# Altium project EE_smallOB_BW_v1.0.PrjPcb (part 3 of 4)

## Sheet ADS_2.SchDoc
size A
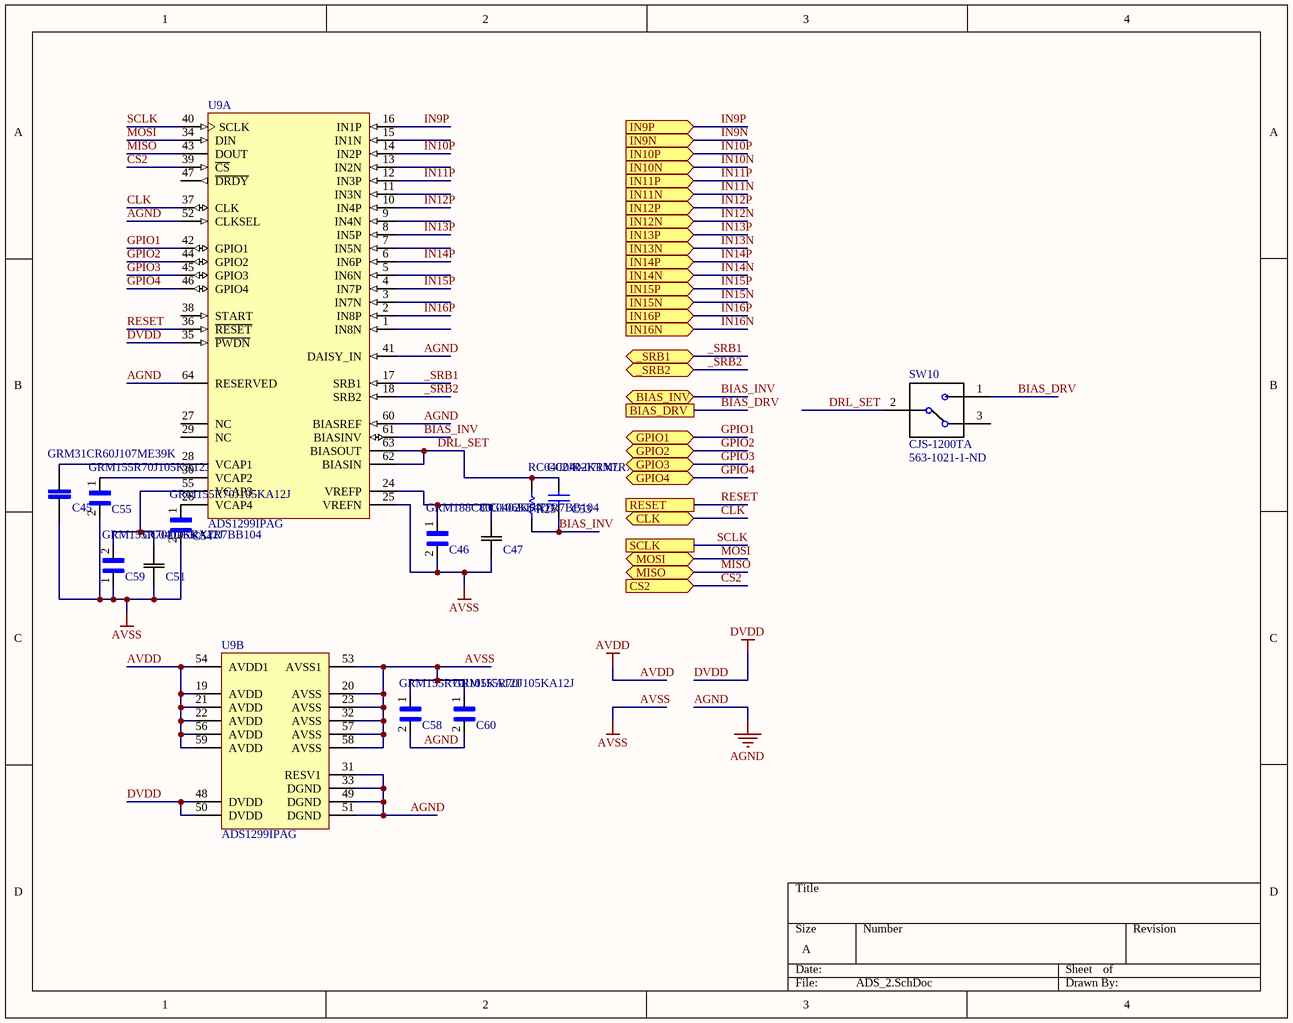
[diagram p2: ADS_2.SchDoc]

### Parts
C45  GRM31CR60J107ME39K  [*CAPC3216X190]
C46  GRM188C80G106KE47D  [*CAPC1608X90N]
C47  CC0402KRX7R7BB104  [YAG_CC0402]
C51  CC0402KRX7R7BB104  [YAG_CC0402]
C53  CC0402KRX7R7BB102  [CAPC1005X55X23NL05T08]
C54  GRM155R70J105KA12J  [*CAPC1005X55N]
C55  GRM155R70J105KA12J  [*CAPC1005X55N]
C58  GRM155R70J105KA12J  [*CAPC1005X55N]
C59  GRM155R70J105KA12J  [*CAPC1005X55N]
C60  GRM155R70J105KA12J  [*CAPC1005X55N]
R25  RC0402JR-071ML  [RESC1005X40X25NL05T10]
SW10  CJS-1200TA  Supplier Part Number 1: 563-1021-1-ND  [*SW_CJS-1200TA]
U9  ADS1299IPAG  [PAG0064A_N]  (parts A,B of 2)

### Ports
_SRB1 (bidir), _SRB2 (bidir), BIAS_DRV, BIAS_INV (bidir), CLK (bidir), CS2 (in), GPIO1 (bidir), GPIO2 (bidir), GPIO3 (bidir), GPIO4 (bidir), IN9N (in), IN9P (in), IN10N (in), IN10P (in), IN11N (in), IN11P (in), IN12N (in), IN12P (in), IN13N (in), IN13P (in), IN14N (in), IN14P (in), IN15N (in), IN15P (in), IN16N (in), IN16P (in), MISO (bidir), MOSI (bidir), RESET, SCLK

### Nets
AGND: C58.2 C60.2 U9.31(RESV1) U9.33(DGND) U9.41(DAISY_IN) U9.49(DGND) U9.51(DGND) U9.52(CLKSEL) U9.60(BIASREF) U9.64(RESERVED)
AVDD: U9.19(AVDD) U9.21(AVDD) U9.22(AVDD) U9.54(AVDD1) U9.56(AVDD) U9.59(AVDD)
AVSS: C45.2 C46.2 C47.2 C51.1 C54.2 C55.2 C58.1 C59.1 C60.1 U9.20(AVSS) U9.23(AVSS) U9.25(VREFN) U9.32(AVSS) U9.53(AVSS1) U9.57(AVSS) U9.58(AVSS)
DVDD: U9.35(~{PWDN}) U9.48(DVDD) U9.50(DVDD)
_SRB1: U9.17(SRB1) ; port _SRB1
_SRB2: U9.18(SRB2) ; port _SRB2
BIAS_DRV: SW10.1 ; port BIAS_DRV
BIAS_INV: C53.2 R25.2 U9.61(BIASINV) ; port BIAS_INV
CLK: U9.37(CLK) ; port CLK
CS2: U9.39(~{CS}) ; port CS2
DRL_SET: C53.1 R25.1 SW10.2 U9.62(BIASIN) U9.63(BIASOUT)
GPIO1: U9.42(GPIO1) ; port GPIO1
GPIO2: U9.44(GPIO2) ; port GPIO2
GPIO3: U9.45(GPIO3) ; port GPIO3
GPIO4: U9.46(GPIO4) ; port GPIO4
IN9N: port IN9N
IN9P: U9.16(IN1P) ; port IN9P
IN10N: port IN10N
IN10P: U9.14(IN2P) ; port IN10P
IN11N: port IN11N
IN11P: U9.12(IN3P) ; port IN11P
IN12N: port IN12N
IN12P: U9.10(IN4P) ; port IN12P
IN13N: port IN13N
IN13P: U9.8(IN5P) ; port IN13P
IN14N: port IN14N
IN14P: U9.6(IN6P) ; port IN14P
IN15N: port IN15N
IN15P: U9.4(IN7P) ; port IN15P
IN16N: port IN16N
IN16P: U9.2(IN8P) ; port IN16P
MISO: U9.43(DOUT) ; port MISO
MOSI: U9.34(DIN) ; port MOSI
RESET: U9.36(~{RESET}) ; port RESET
SCLK: U9.40(SCLK) ; port SCLK
NetC45_1: C45.1 U9.28(VCAP1)
NetC46_1: C46.1 C47.1 U9.24(VREFP)
NetC51_2: C51.2 C59.2 U9.55(VCAP3)
NetC54_1: C54.1 U9.26(VCAP4)
NetC55_1: C55.1 U9.30(VCAP2)

Not connected (* = marked no-connect by the designer): SW10 3; U9 1(IN8N) 3(IN7N) 5(IN6N) 7(IN5N) 9(IN4N) 11(IN3N) 13(IN2N) 15(IN1N) 27(NC) 29(NC) 38(START) 47(~{DRDY})

### Library data of the parts
C45 = GRM31CR60J107ME39K: MURATA - GRM31CR60J107ME39K - COND, 100µF, 6.3V, 20%, X5R, 1206; Capacitance: 100uF; Supplier 1: Digi-Key; Manufacturer 1: Murata; Manufacturer Part Number 1: GRM31CR60J107ME39K; Stock 1: 407390; Pricing 1: 1=0.98000, 10=0.77400, 100=0.58060, 500=0.43870, 1000=0.38709, 2500=0.36128 (USD); RoHS: Yes; Mount: Surface Mount; Case/Package: 1206; Case Code (Imperial): 1206; Case Code (Metric): 3216; Min Operating Temperature: -55°C; Max Operating Temperature: 85°C; Tolerance: 20%; Packaging: Tape and Reel; Package Quantity: 1; Voltage Rating: 6.3V; Dielectric: X5R; Termination: SMD/SMT; Voltage: 6.3V; Voltage Rating (DC): 6.3V; Length: 3.2mm; Height: 1.6mm; Width: 0.063inch; Thickness: 0.071inch; Depth: 1.6mm; Radiation Hardening: No; REACH SVHC: No SVHC; Lead Free: Lead Free; ComponentLink1URL: https://datasheet.ciiva.com/13246/product-13246228.pdf?src-supplier=Mouser; ComponentLink1Description: https://datasheet.ciiva.com/13246/product-13246228.pdf?src-supplier=Mouser; ComponentLink2URL: https://datasheet.ciiva.com/18697/grm31cr60j107me39-01-18697367.pdf?src-supplier=Digi-Key; ComponentLink2Description: https://datasheet.ciiva.com/18697/grm31cr60j107me39-01-18697367.pdf?src-supplier=Digi-Key; ComponentLink3URL: https://datasheet.ciiva.com/18697/grm31cr60j107me39-01-18697368.pdf?src-supplier=Digi-Key; ComponentLink3Description: https://datasheet.ciiva.com/18697/grm31cr60j107me39-01-18697368.pdf?src-supplier=Digi-Key; ComponentLink4URL: https://datasheet.ciiva.com/18697/grm31cr60j107me39-01-18697369.pdf?src-supplier=Digi-Key; ComponentLink4Description: https://datasheet.ciiva.com/18697/grm31cr60j107me39-01-18697369.pdf?src-supplier=Digi-Key; Supplier Part Number 1: 490-7217-1-ND
C46 = GRM188C80G106KE47D: CAP CER 10UF 4V X6S 0603; Manufacturer 1: Murata; Tolerance: 10%; Supplier 1: Digi-Key; Manufacturer Part Number 1: GRM188C80G106KE47D; Stock 1: 203819; Pricing 1: 1=0.17000, 10=0.11800, 100=0.05990, 500=0.04098, 1000=0.03625 (USD); RoHS: Yes; Mount: Surface Mount; Case/Package: 0603; Weight: 0.000222oz; Case Code (Metric): 1608; Case Code (Imperial): 0603; Min Operating Temperature: -55°C; Max Operating Temperature: 105°C; Capacitance: 10uF; Packaging: Tape and Reel; Voltage Rating: 4V; Dielectric: X6S; Termination: SMD/SMT; Voltage Rating (DC): 4V; Package Quantity: 4000; Length: 0.063inch; Height: 0.8mm; Width: 0.031inch; Thickness: 0.035inch; ComponentLink1URL: http://www.mouser.com/ds/2/281/c02e-2905.pdf?src-supplier=Mouser; ComponentLink1Description: http://www.mouser.com/ds/2/281/c02e-2905.pdf?src-supplier=Mouser; ComponentLink2URL: http://search.murata.co.jp/Ceramy/image/img/A01X/G101/ENG/GRM188C80G106KE47-01.pdf?src-supplier=Digi-Key; ComponentLink2Description: http://search.murata.co.jp/Ceramy/image/img/A01X/G101/ENG/GRM188C80G106KE47-01.pdf?src-supplier=Digi-Key; Supplier Part Number 1: 490-10469-1-ND
C47 C51 = CC0402KRX7R7BB104: CAP CER 0.1UF 16V X7R 0402; Manufacturer 1: Yageo; Capacitance: 100nF; Tolerance: 10%; Supplier 1: Digi-Key; Manufacturer Part Number 1: CC0402KRX7R7BB104; Stock 1: 30032352; Pricing 1: 1=0.10000, 10=0.03200, 100=0.01420, 500=0.01014, 1000=0.00797, 2500=0.00724, 5000=0.00667 (USD); RoHS: Yes; Mount: Surface Mount; Case/Package: 0402; Number of Pins: 2; Case Code (Metric): 1005; Case Code (Imperial): 0402; Min Operating Temperature: -55°C; Max Operating Temperature: 125°C; Voltage Rating: 16V; Voltage Rating (DC): 16V; Packaging: Tape and Reel; Package Quantity: 1; Dielectric: X7R; Termination: SMD/SMT; Composition: Ceramic; Voltage: 16V; Length: 1mm; Height: 0.5mm; Width: 0.02inch; Thickness: 0.022inch; Depth: 0.5mm; Radiation Hardening: No; REACH SVHC: No SVHC; Lead Free: Lead Free; Halogen Free: Halogen Free; ComponentLink1URL: https://datasheet.ciiva.com/11788/0900766b80ce67ed-11788364.pdf?src-supplier=RSComponents; ComponentLink1Description: https://datasheet.ciiva.com/11788/0900766b80ce67ed-11788364.pdf?src-supplier=RSComponents; ComponentLink2URL: https://datasheet.ciiva.com/16625/upy-gphc-x7r-6-3v-to-50v-8-16625511.pdf?src-supplier=Avnet+Europe; ComponentLink2Description: https://datasheet.ciiva.com/16625/upy-gphc-x7r-6-3v-to-50v-8-16625511.pdf?src-supplier=Avnet+Europe; ComponentLink3URL: https://datasheet.ciiva.com/161/mlccorderingcode-161544.pdf?src-supplier=Digi-Key; ComponentLink3Description: https://datasheet.ciiva.com/161/mlccorderingcode-161544.pdf?src-supplier=Digi-Key; ComponentLink4URL: https://datasheet.ciiva.com/161/mlccorderingcode-161545.pdf?src-supplier=Digi-Key; ComponentLink4Description: https://datasheet.ciiva.com/161/mlccorderingcode-161545.pdf?src-supplier=Digi-Key; ComponentLink5URL: https://datasheet.ciiva.com/8033/1734573-8033661.pdf?src-supplier=Element14; ComponentLink5Description: https://datasheet.ciiva.com/8033/1734573-8033661.pdf?src-supplier=Element14; ComponentLink6URL: https://datasheet.ciiva.com/7978/1489800-7978111.pdf?src-supplier=Element14; ComponentLink6Description: https://datasheet.ciiva.com/7978/1489800-7978111.pdf?src-supplier=Element14; ComponentLink7URL: https://datasheet.ciiva.com/8033/1734573-8033663.pdf?src-supplier=Element14; ComponentLink7Description: https://datasheet.ciiva.com/8033/1734573-8033663.pdf?src-supplier=Element14; ComponentLink8URL: https://datasheet.ciiva.com/11587/upy-gphc-x7r-6-3v-to-50v-8-11587305.pdf?src-supplier=Avnet; ComponentLink8Description: https://datasheet.ciiva.com/11587/upy-gphc-x7r-6-3v-to-50v-8-11587305.pdf?src-supplier=Avnet; ComponentLink9URL: https://datasheet.ciiva.com/161/mlccorderingcode-161546.pdf?src-supplier=Digi-Key; ComponentLink9Description: https://datasheet.ciiva.com/161/mlccorderingcode-161546.pdf?src-supplier=Digi-Key; ComponentLink10URL: https://datasheet.ciiva.com/13395/upy-gphc-x7r-6-3v-to-50v-8-13395676.pdf?src-supplier=Mouser; ComponentLink10Description: https://datasheet.ciiva.com/13395/upy-gphc-x7r-6-3v-to-50v-8-13395676.pdf?src-supplier=Mouser; ComponentLink11URL: https://datasheet.ciiva.com/28450/1489800-28450335.pdf?src-supplier=Element14; ComponentLink11Description: https://datasheet.ciiva.com/28450/1489800-28450335.pdf?src-supplier=Element14; Supplier Part Number 1: 311-1338-1-ND
C53 = CC0402KRX7R7BB102: CAP CER 1000PF 16V X7R 0402; Manufacturer 1: Yageo; Capacitance: 1nF; Tolerance: 10%; Supplier 1: Digi-Key; Manufacturer Part Number 1: CC0402KRX7R7BB102; Stock 1: 319318; Pricing 1: 1=0.10000, 10=0.02000, 100=0.00910, 500=0.00646, 1000=0.00508, 2500=0.00462, 5000=0.00425 (USD); RoHS: Yes; Mount: Surface Mount; Case/Package: 0402; Case Code (Imperial): 0402; Case Code (Metric): 1005; Min Operating Temperature: -55°C; Max Operating Temperature: 125°C; Packaging: Tape and Reel; Voltage Rating: 16V; Voltage Rating (DC): 16V; Package Quantity: 1; Dielectric: X7R; Termination: SMD/SMT; Composition: Ceramic; Length: 1mm; Height: 0.5mm; Width: 0.5mm; Thickness: 0.022inch; Depth: 0.5mm; Radiation Hardening: No; REACH SVHC: No SVHC; Lead Free: Lead Free; Halogen Free: Halogen Free; ComponentLink1URL: https://datasheet.ciiva.com/143/mlccorderingcode-143963.pdf?src-supplier=Digi-Key; ComponentLink1Description: https://datasheet.ciiva.com/143/mlccorderingcode-143963.pdf?src-supplier=Digi-Key; ComponentLink2URL: https://datasheet.ciiva.com/26862/getdatasheetpartid-698313-26862635.pdf?src-supplier=Verical; ComponentLink2Description: https://datasheet.ciiva.com/26862/getdatasheetpartid-698313-26862635.pdf?src-supplier=Verical; ComponentLink3URL: https://datasheet.ciiva.com/143/mlccorderingcode-143964.pdf?src-supplier=Digi-Key; ComponentLink3Description: https://datasheet.ciiva.com/143/mlccorderingcode-143964.pdf?src-supplier=Digi-Key; ComponentLink4URL: https://datasheet.ciiva.com/17437/upy-gphc-x7r-6-3v-to-50v-8-17437337.pdf?src-supplier=Avnet+Europe; ComponentLink4Description: https://datasheet.ciiva.com/17437/upy-gphc-x7r-6-3v-to-50v-8-17437337.pdf?src-supplier=Avnet+Europe; ComponentLink5URL: https://datasheet.ciiva.com/143/mlccorderingcode-143962.pdf?src-supplier=Digi-Key; ComponentLink5Description: https://datasheet.ciiva.com/143/mlccorderingcode-143962.pdf?src-supplier=Digi-Key; ComponentLink6URL: https://datasheet.ciiva.com/7978/1489800-7978107.pdf?src-supplier=Element14; ComponentLink6Description: https://datasheet.ciiva.com/7978/1489800-7978107.pdf?src-supplier=Element14; ComponentLink7URL: https://datasheet.ciiva.com/11464/upy-gphc-x7r-6-3v-to-50v-8-11464876.pdf?src-supplier=Avnet; ComponentLink7Description: https://datasheet.ciiva.com/11464/upy-gphc-x7r-6-3v-to-50v-8-11464876.pdf?src-supplier=Avnet; Supplier Part Number 1: 311-1352-1-ND
C54 C55 C58-C60 = GRM155R70J105KA12J: CAP CER 1UF 6.3V X7R 0402; Manufacturer 1: Murata; Tolerance: 10%; Supplier 1: Digi-Key; Manufacturer Part Number 1: GRM155R70J105KA12J; Stock 1: 3268614; Pricing 1: 1=0.11000, 10=0.07900, 100=0.03700, 500=0.02596, 1000=0.02149, 2500=0.02000, 5000=0.01830 (USD); RoHS: Yes; Mount: Surface Mount; Case/Package: 0402; Weight: 0.000212oz; Case Code (Metric): 1005; Case Code (Imperial): 0402; Min Operating Temperature: -55°C; Max Operating Temperature: 125°C; Packaging: Tape and Reel; Capacitance: 1uF; Voltage Rating: 6.3V; Dielectric: X7R; Termination: SMD/SMT; Voltage Rating (DC): 6.3V; Package Quantity: 50000; Length: 0.039inch; Width: 0.02inch; Thickness: 0.022inch; ComponentLink1URL: http://www.mouser.com/ds/2/281/c02e-2905.pdf?src-supplier=Mouser; ComponentLink1Description: http://www.mouser.com/ds/2/281/c02e-2905.pdf?src-supplier=Mouser; ComponentLink2URL: http://search.murata.co.jp/Ceramy/image/img/A01X/G101/ENG/GRM155R70J105KA12-01.pdf?src-supplier=Digi-Key; ComponentLink2Description: http://search.murata.co.jp/Ceramy/image/img/A01X/G101/ENG/GRM155R70J105KA12-01.pdf?src-supplier=Digi-Key; Supplier Part Number 1: 490-13339-1-ND
R25 = RC0402JR-071ML: RES SMD 1M OHM 5% 1/16W 0402; Manufacturer 1: Yageo; Resistance: 1MR; Power Rating: 62.5mW; Voltage Rating: 50V; Temperature Coefficient: 100ppm/°C; Max Power Dissipation: 63mW; Supplier 1: Digi-Key; Manufacturer Part Number 1: RC0402JR-071ML; Stock 1: 2568291; Pricing 1: 1=0.10000, 10=0.01300, 100=0.00550, 1000=0.00245, 2500=0.00212, 5000=0.00176 (USD); RoHS: Yes; Case/Package: 0402; Weight: 2.3E-05oz; Case Code (Metric): 1005; Case Code (Imperial): 0402; Min Operating Temperature: -55°C; Max Operating Temperature: 155°C; Package Quantity: 1; Tolerance: 5%; Packaging: Tape and Reel; Composition: Thick Film; Number of Terminations: 2; Termination: SMD/SMT; Military Standard: Not; Features: Moisture Resistant; Length: 1mm; Height: 0.016inch; Width: 0.02inch; Depth: 0.5mm; REACH SVHC: No SVHC; Lead Free: Lead Free; ComponentLink1URL: https://datasheet.ciiva.com/2452/pyu-r-int-thick-7-2452736.pdf?src-supplier=Digi-Key; ComponentLink1Description: https://datasheet.ciiva.com/2452/pyu-r-int-thick-7-2452736.pdf?src-supplier=Digi-Key; ComponentLink2URL: https://datasheet.ciiva.com/7983/1018594-7983560.pdf?src-supplier=Element14; ComponentLink2Description: https://datasheet.ciiva.com/7983/1018594-7983560.pdf?src-supplier=Element14; ComponentLink3URL: https://datasheet.ciiva.com/12577/pyu-rc0402-51-rohs-l-6-r-12577354.pdf?src-supplier=Mouser; ComponentLink3Description: https://datasheet.ciiva.com/12577/pyu-rc0402-51-rohs-l-6-r-12577354.pdf?src-supplier=Mouser; ComponentLink4URL: https://datasheet.ciiva.com/17085/pyu-rc0402-51-rohs-l-6-r-17085739.pdf?src-supplier=Future+Electronics; ComponentLink4Description: https://datasheet.ciiva.com/17085/pyu-rc0402-51-rohs-l-6-r-17085739.pdf?src-supplier=Future+Electronics; ComponentLink5URL: https://datasheet.ciiva.com/7850/1018594-7850172.pdf?src-supplier=Element14; ComponentLink5Description: https://datasheet.ciiva.com/7850/1018594-7850172.pdf?src-supplier=Element14; ComponentLink6URL: https://datasheet.ciiva.com/7850/1018594-7850173.pdf?src-supplier=Element14; ComponentLink6Description: https://datasheet.ciiva.com/7850/1018594-7850173.pdf?src-supplier=Element14; ComponentLink7URL: https://datasheet.ciiva.com/2452/pyu-r-int-thick-7-2452734.pdf?src-supplier=Digi-Key; ComponentLink7Description: https://datasheet.ciiva.com/2452/pyu-r-int-thick-7-2452734.pdf?src-supplier=Digi-Key; ComponentLink8URL: https://datasheet.ciiva.com/2452/pyu-r-int-thick-7-2452735.pdf?src-supplier=Digi-Key; ComponentLink8Description: https://datasheet.ciiva.com/2452/pyu-r-int-thick-7-2452735.pdf?src-supplier=Digi-Key; Supplier Part Number 1: 311-1.0MJRCT-ND
SW10 = CJS-1200TA: SWITCH SLIDE SPDT 100MA 6V; Manufacturer 1: Nidec Copal; Body Material: Polyphenylene; Number of Positions: 2; Electrical Life: 200Cycles; Max Voltage Rating (DC): 24V; Actuator Type: Slide (Standard); Washable: Yes; Supplier 1: Digi-Key; Manufacturer Part Number 1: CJS-1200TA; Stock 1: 72766; Pricing 1: 1=0.88000, 10=0.86000, 25=0.81000, 50=0.76040, 100=0.72730, 250=0.69428, 500=0.62814 (USD); RoHS: Yes; Mount: Surface Mount; Contact Material: Copper Alloy; Contact Plating: Gold; Min Operating Temperature: -40°C; Max Operating Temperature: 85°C; Packaging: Tape and Reel; Throw Configuration: SPDT; Voltage Rating (DC): 6V; Current Rating: 100mA; Termination: J-Hook; Orientation: Vertical; Length: 0.212inch; Radiation Hardening: No; Lead Free: Lead Free; ComponentLink1URL: https://datasheet.ciiva.com/2864/cjs-2864476.pdf?src-supplier=Digi-Key; ComponentLink1Description: https://datasheet.ciiva.com/2864/cjs-2864476.pdf?src-supplier=Digi-Key; ComponentLink2URL: https://datasheet.ciiva.com/2864/cjs-2864477.pdf?src-supplier=Digi-Key; ComponentLink2Description: https://datasheet.ciiva.com/2864/cjs-2864477.pdf?src-supplier=Digi-Key; ComponentLink3URL: https://datasheet.ciiva.com/2864/cjs-2864478.pdf?src-supplier=Digi-Key; ComponentLink3Description: https://datasheet.ciiva.com/2864/cjs-2864478.pdf?src-supplier=Digi-Key
U9 = ADS1299IPAG: IC AFE 24BIT 16KSPS LN 64TQFP; Manufacturer 1: Texas Instruments; Number of Channels: 8; Max Power Dissipation: 42mW; Max Supply Voltage: 5.25V; Interface: SPI; Resolution: 24b; Number of Bits: 24; Sampling Rate: 16KS/s; Operating Supply Current: 7.14mA; Signal to Noise Ratio (SNR): 121dB; Power Consumption: 41mW; Min Supply Voltage: 4.75V; Supplier 1: Digi-Key; Manufacturer Part Number 1: ADS1299IPAG; Stock 1: 447; Pricing 1: 1=55.18000, 10=51.83200, 25=50.16000, 100=46.48160 (USD); RoHS: Yes; Case/Package: TQFP; Number of Pins: 64; Contact Plating: Gold; Min Operating Temperature: -40°C; Max Operating Temperature: 85°C; Package Quantity: 160; Packaging: Rail/Tube; Number of Converters: 8; Conversion Rate: 16KS/s; Number of Inputs: 8; Number of A/D Converters: 8; Type: General Purpose; Radiation Hardening: No; Lead Free: Lead Free; REACH SVHC: No SVHC; ComponentLink1URL: https://datasheet.ciiva.com/13063/ads1299-224171-13063283.pdf?src-supplier=Mouser; ComponentLink1Description: https://datasheet.ciiva.com/13063/ads1299-224171-13063283.pdf?src-supplier=Mouser; ComponentLink2URL: https://datasheet.ciiva.com/26913/getdatasheetpartid-563195-26913237.pdf?src-supplier=Verical; ComponentLink2Description: https://datasheet.ciiva.com/26913/getdatasheetpartid-563195-26913237.pdf?src-supplier=Verical; ComponentLink3URL: https://datasheet.ciiva.com/6668/ads1299-6668469.pdf?src-supplier=Digi-Key; ComponentLink3Description: https://datasheet.ciiva.com/6668/ads1299-6668469.pdf?src-supplier=Digi-Key; Supplier Part Number 1: 296-35009-ND

## Sheet wifi.SchDoc
size A
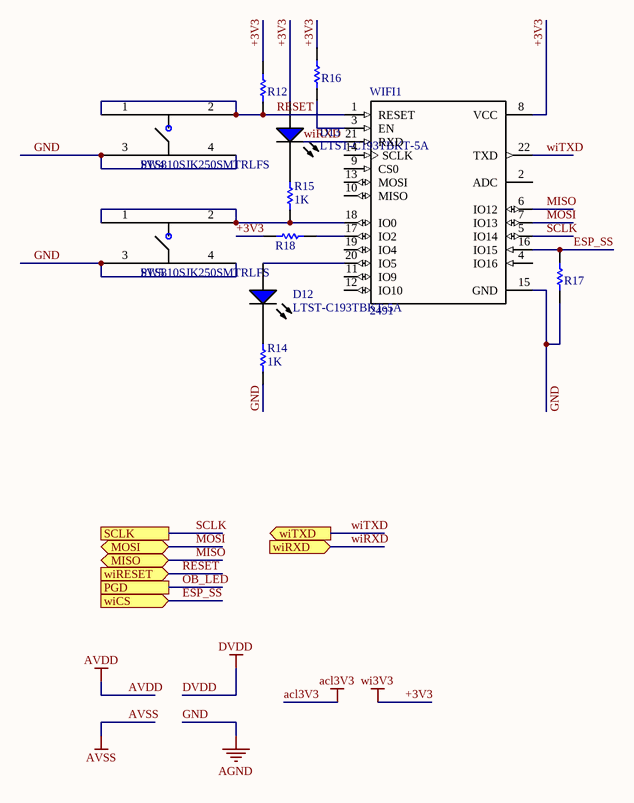
[diagram p3: wifi.SchDoc]

### Parts
D12  LTST-C193TBKT-5A  [LTST-C193TBKT_V]
D13  LTST-C193TBKT-5A  [LTST-C193TBKT_V]
R12  10K  [RESC1609X55X30NL15T15]  (value not drawn)
R14  1K  [RESC1609X55X30NL15T15]
R15  1K  [RESC1609X55X30NL15T15]
R16  10K  [RESC1609X55X30NL15T15]  (value not drawn)
R17  10K  [RESC1609X55X30NL15T15]  (value not drawn)
R18  10K  [RESC1609X55X30NL15T15]  (value not drawn)
SW4  PTS810SJK250SMTRLFS  [PTS810]
SW5  PTS810SJK250SMTRLFS  [PTS810]
WIFI1  2491  [*XCVR_ESP8266-12E/ESP-12E]

### Ports
MISO (bidir), MOSI (bidir), PGD, SCLK, wiCS (in), wiRESET (in), wiRXD (in), wiTXD (out)

### Nets
+3V3: D13.1(A) R12.2 R16.2 R18.2 WIFI1.8(VCC)  [also labelled wi3V3]
AGND: R14.1 R17.1 SW4.3 SW4.4 SW5.3 SW5.4 WIFI1.15(GND)  [also labelled GND]
ESP_SS: R17.2 WIFI1.16(IO15) ; port wiCS  [project net D13]
MISO: WIFI1.6(IO12) ; port MISO
MOSI: WIFI1.7(IO13) ; port MOSI
RESET: R12.1 SW4.1 SW4.2 WIFI1.1(RESET) ; port wiRESET  [project net D18]
SCLK: WIFI1.5(IO14) ; port SCLK
wiRXD: WIFI1.21(RXD) ; port wiRXD
wiTXD: WIFI1.22(TXD) ; port wiTXD
NetD12_1: D12.1(A) WIFI1.20(IO5)
NetD12_2: D12.2(K) R14.2
NetD13_2: D13.2(K) R15.2
NetR15_1: R15.1 SW5.1 SW5.2 WIFI1.18(IO0)
NetR16_1: R16.1 WIFI1.3(EN)
NetR18_1: R18.1 WIFI1.17(IO2)

Not connected (* = marked no-connect by the designer): WIFI1 2(ADC) 4(IO16) 9(CS0) 10(MISO) 11(IO9) 12(IO10) 13(MOSI) 14(SCLK) 19(IO4)

### Library data of the parts
D12 D13 = LTST-C193TBKT-5A: LED BLUE CLEAR CHIP SMD; Manufacturer 1: Vishay Lite-On; Lens Color: Colorless; Forward Current: 20mA; Forward Voltage: 2.8V; Luminous Intensity: 15mcd; Viewing Angle: 130°; Lens Style: Diffused,Colorless,Rectangular,Clear; Dominant Wavelength: 475nm; Test Current: 5mA; Number of Elements: 1; Power Dissipation: 76mW; Reverse Voltage: 5V; Supplier 1: Digi-Key; Manufacturer Part Number 1: LTST-C193TBKT-5A; Stock 1: 141970; Pricing 1: 1=0.45000, 10=0.32000, 100=0.14240, 500=0.09968, 1000=0.08188, 2500=0.07120 (USD); RoHS: Yes; Mount: Surface Mount; Case/Package: 0603; Number of Pins: 2; Color: Blue; Case Code (Metric): 1608; Case Code (Imperial): 0603; Min Operating Temperature: -20°C; Max Operating Temperature: 80°C; Packaging: Tape and Reel; Package Quantity: 1; Illumination Color: Blue; Lens Transparency: Clear; Number of LEDs: 1; Length: 1.6mm; Height: 0.35mm; Width: 0.8mm; Depth: 0.8mm; Radiation Hardening: No; Lead Free: Lead Free; ComponentLink1URL: https://datasheet.ciiva.com/4688/lite-on-ltst-c193tbkt-5a-187386-4688832.pdf?src-supplier=Mouser; ComponentLink1Description: https://datasheet.ciiva.com/4688/lite-on-ltst-c193tbkt-5a-187386-4688832.pdf?src-supplier=Mouser; ComponentLink2URL: https://datasheet.ciiva.com/2111/ltst-c193tbkt-5a-2111219.pdf?src-supplier=Digi-Key; ComponentLink2Description: https://datasheet.ciiva.com/2111/ltst-c193tbkt-5a-2111219.pdf?src-supplier=Digi-Key; ComponentLink3URL: https://datasheet.ciiva.com/15201/getdatasheetpartid-293056-15201395.pdf?src-supplier=Verical; ComponentLink3Description: https://datasheet.ciiva.com/15201/getdatasheetpartid-293056-15201395.pdf?src-supplier=Verical; ComponentLink4URL: https://datasheet.ciiva.com/11773/0900766b80dc0554-11773880.pdf?src-supplier=RSComponents; ComponentLink4Description: https://datasheet.ciiva.com/11773/0900766b80dc0554-11773880.pdf?src-supplier=RSComponents; ComponentLink5URL: https://datasheet.ciiva.com/16210/ltst-c193tbkt-5a-16210824.pdf?src-supplier=Future+Electronics; ComponentLink5Description: https://datasheet.ciiva.com/16210/ltst-c193tbkt-5a-16210824.pdf?src-supplier=Future+Electronics; ComponentLink6URL: https://datasheet.ciiva.com/2111/p-100-ltst-c193tbkt-5a-2111220.pdf?src-supplier=Digi-Key; ComponentLink6Description: https://datasheet.ciiva.com/2111/p-100-ltst-c193tbkt-5a-2111220.pdf?src-supplier=Digi-Key; ComponentLink7URL: https://datasheet.ciiva.com/2111/p-100-ltst-c193tbkt-5a-2111221.pdf?src-supplier=Digi-Key; ComponentLink7Description: https://datasheet.ciiva.com/2111/p-100-ltst-c193tbkt-5a-2111221.pdf?src-supplier=Digi-Key; Supplier Part Number 1: 160-1827-1-ND
R12 R16-R18 = ERJ-3EKF1002V: Res Thick Film 0603 10K Ohm 1% 1/10W ±100ppm/°C Molded SMD Punched Carrier T/R; Manufacturer 1: Panasonic; Resistance: 10kR; Power Rating: 100mW; Voltage Rating: 75V; Supplier 1: Digi-Key; Manufacturer Part Number 1: ERJ-3EKF1002V; Stock 1: 6176372; Pricing 1: 1=0.10000, 10=0.06500, 100=0.02640, 1000=0.01186, 2500=0.01029 (USD); RoHS: Yes; Mount: Surface Mount; Case/Package: 0603; Number of Pins: 2; Case Code (Metric): 1608; Case Code (Imperial): 0603; Contact Plating: Tin; Min Operating Temperature: -55°C; Max Operating Temperature: 155°C; Tolerance: 1%; Packaging: Tape and Reel; Package Quantity: 1; Composition: Thick Film; Number of Terminations: 2; Termination: SMD/SMT; Temperature Coefficient: 100ppm/°C; Military Standard: Not; Max Power Dissipation: 100mW; Voltage Rating (DC): 75V; Features: Automotive AEC-Q200; Length: 1.6mm; Height: 0.45mm; Width: 0.031inch; Depth: 0.8mm; Radiation Hardening: No; REACH SVHC: No SVHC; Lead Free: Lead Free; ComponentLink1URL: http://www.farnell.com/datasheets/1911175.pdf?src-supplier=Farnell; ComponentLink1Description: http://www.farnell.com/datasheets/1911175.pdf?src-supplier=Farnell; ComponentLink2URL: http://components.arrow.com/part/dataview/0323_02069964?src-supplier=Arrow+Europe; ComponentLink2Description: http://components.arrow.com/part/dataview/0323_02069964?src-supplier=Arrow+Europe; ComponentLink3URL: https://industrial.panasonic.com/cdbs/www-data/pdf/RDA0000/DMA0000COL11.pdf?src-supplier=Distrelec; ComponentLink3Description: https://industrial.panasonic.com/cdbs/www-data/pdf/RDA0000/DMA0000COL11.pdf?src-supplier=Distrelec; ComponentLink4URL: https://industrial.panasonic.com/cdbs/www-data/pdf/RDA0000/DMA0000COL11.pdf?src-supplier=Future+Electronics; ComponentLink4Description: https://industrial.panasonic.com/cdbs/www-data/pdf/RDA0000/DMA0000COL11.pdf?src-supplier=Future+Electronics; ComponentLink5URL: http://www.jameco.com/Jameco/Products/ProdDS/1987468.pdf?src-supplier=Jameco; ComponentLink5Description: http://www.jameco.com/Jameco/Products/ProdDS/1987468.pdf?src-supplier=Jameco; ComponentLink6URL: https://industrial.panasonic.com/cdbs/www-data/pdf/RDA0000/DMA0000COL11.pdf?src-supplier=Allied+Electronics; ComponentLink6Description: https://industrial.panasonic.com/cdbs/www-data/pdf/RDA0000/DMA0000COL11.pdf?src-supplier=Allied+Electronics; ComponentLink7URL: https://industrial.panasonic.com/cdbs/www-data/pdf/RDA0000/DMA0000COL11.pdf?src-supplier=Conrad; ComponentLink7Description: https://industrial.panasonic.com/cdbs/www-data/pdf/RDA0000/DMA0000COL11.pdf?src-supplier=Conrad
R14 R15 = ERJ3EKF1001V: Res Thick Film 0603 1K Ohm 1% 1/10W ±100ppm/°C Molded SMD Punched Carrier T/R; Manufacturer 1: Panasonic; Resistance: 1kR; Power Rating: 100mW; Voltage Rating: 75V; Supplier 1: Digi-Key; Manufacturer Part Number 1: ERJ3EKF1001V; Stock 1: 7716058; Pricing 1: 1=0.100000, 10=0.055000, 100=0.022400, 1000=0.010050, 2500=0.008720 (USD); RoHS: Yes; Mount: Surface Mount; Case/Package: 0603; Number of Pins: 2; Case Code (Metric): 1608; Case Code (Imperial): 0603; Contact Plating: Tin; Min Operating Temperature: -55°C; Max Operating Temperature: 155°C; Packaging: Tape and Reel; Tolerance: 1%; Package Quantity: 5000; Composition: Thick Film; Number of Terminations: 2; Termination: SMD/SMT; Military Standard: Not; Temperature Coefficient: 100ppm/°C; Max Power Dissipation: 100mW; Voltage Rating (DC): 75V; Features: Automotive AEC-Q200; Length: 1.6mm; Height: 0.45mm; Width: 0.8mm; Depth: 0.8mm; Radiation Hardening: No; REACH SVHC: No SVHC; Lead Free: Lead Free; ComponentLink1URL: https://datasheet.ciiva.com/16768/70260748-16768437.pdf?src-supplier=Allied+Electronics; ComponentLink1Description: https://datasheet.ciiva.com/16768/70260748-16768437.pdf?src-supplier=Allied+Electronics; ComponentLink2URL: https://datasheet.ciiva.com/16774/70260748-16774550.pdf?src-supplier=Allied+Electronics; ComponentLink2Description: https://datasheet.ciiva.com/16774/70260748-16774550.pdf?src-supplier=Allied+Electronics; ComponentLink3URL: https://datasheet.ciiva.com/16449/aoa0000ce2-16449065.pdf?src-supplier=Future+Electronics; ComponentLink3Description: https://datasheet.ciiva.com/16449/aoa0000ce2-16449065.pdf?src-supplier=Future+Electronics; ComponentLink4URL: https://datasheet.ciiva.com/7942/aoa0000ce2-7942427.pdf?src-supplier=Element14; ComponentLink4Description: https://datasheet.ciiva.com/7942/aoa0000ce2-7942427.pdf?src-supplier=Element14; ComponentLink5URL: https://datasheet.ciiva.com/9198/aoa0000ce2-9198923.pdf?src-supplier=Avnet; ComponentLink5Description: https://datasheet.ciiva.com/9198/aoa0000ce2-9198923.pdf?src-supplier=Avnet; ComponentLink6URL: https://datasheet.ciiva.com/46373/1678782-46373339.pdf?src-supplier=Element14; ComponentLink6Description: https://datasheet.ciiva.com/46373/1678782-46373339.pdf?src-supplier=Element14; ComponentLink7URL: https://datasheet.ciiva.com/48530/aoa0000ce2-48530987.pdf?src-supplier=Avnet; ComponentLink7Description: https://datasheet.ciiva.com/48530/aoa0000ce2-48530987.pdf?src-supplier=Avnet; ComponentLink8URL: https://datasheet.ciiva.com/46373/1678782-46373340.pdf?src-supplier=Element14; ComponentLink8Description: https://datasheet.ciiva.com/46373/1678782-46373340.pdf?src-supplier=Element14; ComponentLink9URL: https://datasheet.ciiva.com/24070/aoa0000ce2-24070269.pdf?src-supplier=Mouser; ComponentLink9Description: https://datasheet.ciiva.com/24070/aoa0000ce2-24070269.pdf?src-supplier=Mouser; ComponentLink10URL: https://datasheet.ciiva.com/22673/1678782-22673918.pdf?src-supplier=Element14; ComponentLink10Description: https://datasheet.ciiva.com/22673/1678782-22673918.pdf?src-supplier=Element14; ComponentLink11URL: https://datasheet.ciiva.com/30063/aoa0000ce2-30063390.pdf?src-supplier=Onlinecomponents.com; ComponentLink11Description: https://datasheet.ciiva.com/30063/aoa0000ce2-30063390.pdf?src-supplier=Onlinecomponents.com; ComponentLink12URL: https://datasheet.ciiva.com/17215/aoa0000ce2-17215311.pdf?src-supplier=Avnet+Europe; ComponentLink12Description: https://datasheet.ciiva.com/17215/aoa0000ce2-17215311.pdf?src-supplier=Avnet+Europe
SW4 SW5 = PTS810SJK250SMTRLFS: SWITCH TACTILE SPST-NO 0.05A 16V; Manufacturer 1: ITT C&K; Mechanical Life: 50000Cycles; Throw Configuration: SPST; Operating Force: 260gf; Max Current Rating: 50mA; Illumination Type: Non-Illuminated; Switch Travel: 0.15mm; Switch Function: Off-Mom; Actuator Type: Standard; Supplier 1: Digi-Key; Manufacturer Part Number 1: PTS810SJK250SMTRLFS; Stock 1: 61508; Pricing 1: 1=0.30000, 10=0.28700, 25=0.27680, 50=0.26700, 100=0.25210, 250=0.23728, 500=0.22740, 1000=0.17302 (USD); RoHS: Yes; Mount: Surface Mount; Case/Package: SMD/SMT; Color: White; Contact Plating: Silver; Min Operating Temperature: -40°C; Max Operating Temperature: 85°C; Packaging: Tape and Reel; Current Rating: 50mA; Voltage Rating (DC): 16V; Package Quantity: 1; Termination: J-Bend; Orientation: Straight; Length: 3.2mm; Depth: 4.6mm; Lead Free: Lead Free; ComponentLink1URL: https://datasheet.ciiva.com/18514/pts810-4mar13-18514061.pdf?src-supplier=Digi-Key; ComponentLink1Description: https://datasheet.ciiva.com/18514/pts810-4mar13-18514061.pdf?src-supplier=Digi-Key; ComponentLink2URL: https://datasheet.ciiva.com/18514/pts810-4mar13-18514063.pdf?src-supplier=Digi-Key; ComponentLink2Description: https://datasheet.ciiva.com/18514/pts810-4mar13-18514063.pdf?src-supplier=Digi-Key; ComponentLink3URL: https://datasheet.ciiva.com/18514/pts810-4mar13-18514062.pdf?src-supplier=Digi-Key; ComponentLink3Description: https://datasheet.ciiva.com/18514/pts810-4mar13-18514062.pdf?src-supplier=Digi-Key; Supplier Part Number 1: CKN10503CT-ND
WIFI1 = 2491: ESP8266 SMT MODULE; Manufacturer 1: Adafruit Industries; Frequency: 2.4GHz; Data Rate: 72.2Mbps; Sensitivity: -91dBm; Interface: I2C,SPI,UART; Current - Receiving: 56mA; Current - Transmitting: 170mA; Supplier 1: Digi-Key; Manufacturer Part Number 1: 2491; Stock 1: 992; Pricing 1: 1=6.95000 (USD); RoHS: Yes; Mount: Surface Mount; Case/Package: Module; Min Operating Temperature: -40°C; Max Operating Temperature: 125°C; Packaging: Bulk; ComponentLink1URL: https://www.mouser.com/ds/2/737/0A-ESP8266__Datasheet__EN_v4.3-1095239.pdf?src-supplier=Mouser; ComponentLink1Description: https://www.mouser.com/ds/2/737/0A-ESP8266__Datasheet__EN_v4.3-1095239.pdf?src-supplier=Mouser; ComponentLink2URL: https://www.adafruit.com/images/product-files/2471/0A-ESP8266__Datasheet__EN_v4.3.pdf?src-supplier=Digi-Key; ComponentLink2Description: https://www.adafruit.com/images/product-files/2471/0A-ESP8266__Datasheet__EN_v4.3.pdf?src-supplier=Digi-Key; Supplier Part Number 1: 1528-1438-ND

## Sheet sd_accel.SchDoc
size A
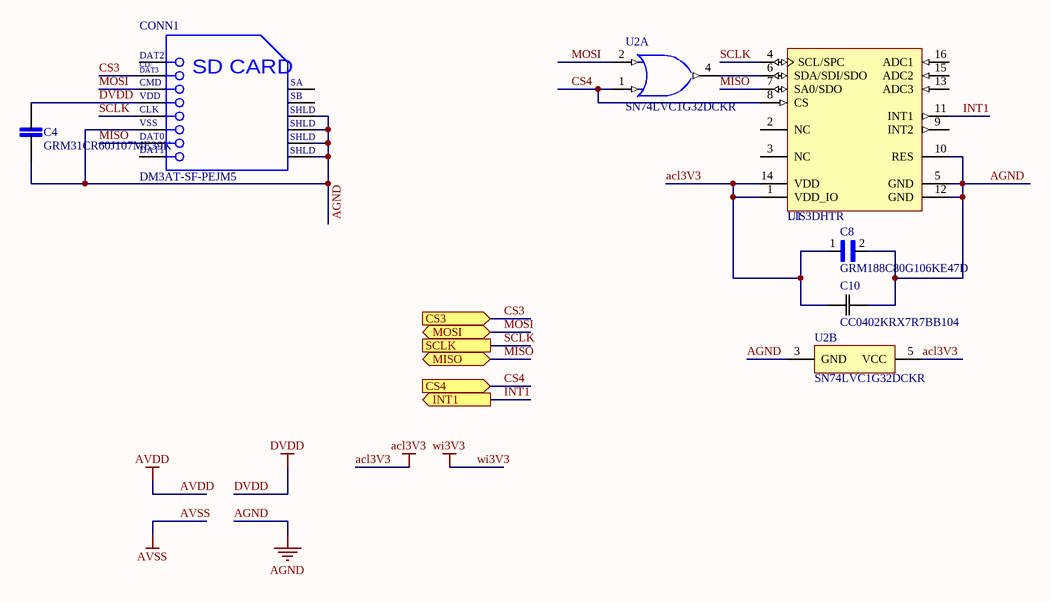
[diagram p4: sd_accel.SchDoc]

### Parts
C4  GRM31CR60J107ME39K  [*CAPC3216X190]
C8  GRM188C80G106KE47D  [*CAPC1608X90N]
C10  CC0402KRX7R7BB104  [YAG_CC0402]
CONN1  DM3AT-SF-PEJM5  [HRS-DM3AT-8_V]
U1  LIS3DHTR  [STM-LGA-16]
U2  SN74LVC1G32DCKR  [DCK0005A_N]  (parts A,B of 2)

### Ports
CS3 (in), CS4 (in), INT1 (out), MISO (bidir), MOSI (bidir), SCLK

### Nets
acl3V3: C8.1 C10.1 U1.1(VDD_IO) U1.14(VDD) U2.5(VCC)
AGND: C4.2 C8.2 C10.2 CONN1.6(VSS) CONN1.11(SHLD) CONN1.12(SHLD) CONN1.13(SHLD) CONN1.14(SHLD) U1.5(GND) U1.10(RES) U1.12(GND) U2.3(GND)
DVDD: C4.1 CONN1.4(VDD)
CS3: CONN1.2(CD/DAT3) ; port CS3
CS4: U1.8(CS) U2.1(A) ; port CS4
INT1: U1.11(INT1) ; port INT1
MISO: CONN1.7(DAT0) U1.7(SA0/SDO) ; port MISO
MOSI: CONN1.3(CMD) U2.2(B) ; port MOSI
SCLK: CONN1.5(CLK) U1.4(SCL/SPC) ; port SCLK
NetU1_6: U1.6(SDA/SDI/SDO) U2.4(Y)

Not connected (* = marked no-connect by the designer): CONN1 1(DAT2) 8(DAT1) 9(SA) 10(SB); U1 2(NC) 3(NC) 9(INT2) 13(ADC3) 15(ADC2) 16(ADC1)

### Notes on the sheet
- (in symbol DM3AT-SF-PEJM5) CD/; DAT3; SD CARD

### Library data of the parts
C4 = GRM31CR60J107ME39K: as C45 on sheet ADS_2; Supplier 1: Digi-Key; Manufacturer 1: Murata; Manufacturer Part Number 1: GRM31CR60J107ME39K; Stock 1: 407390; Pricing 1: 1=0.98000, 10=0.77400, 100=0.58060, 500=0.43870, 1000=0.38709, 2500=0.36128 (USD); RoHS: Yes; Mount: Surface Mount; Case/Package: 1206; Case Code (Imperial): 1206; Case Code (Metric): 3216; Min Operating Temperature: -55°C; Max Operating Temperature: 85°C; Tolerance: 20%; Packaging: Tape and Reel; Package Quantity: 1; Voltage Rating: 6.3V; Dielectric: X5R; Termination: SMD/SMT; Voltage: 6.3V; Voltage Rating (DC): 6.3V; Length: 3.2mm; Height: 1.6mm; Width: 0.063inch; Thickness: 0.071inch; Depth: 1.6mm; Radiation Hardening: No; REACH SVHC: No SVHC; Lead Free: Lead Free; ComponentLink1URL: https://datasheet.ciiva.com/13246/product-13246228.pdf?src-supplier=Mouser; ComponentLink1Description: https://datasheet.ciiva.com/13246/product-13246228.pdf?src-supplier=Mouser; ComponentLink2URL: https://datasheet.ciiva.com/18697/grm31cr60j107me39-01-18697367.pdf?src-supplier=Digi-Key; ComponentLink2Description: https://datasheet.ciiva.com/18697/grm31cr60j107me39-01-18697367.pdf?src-supplier=Digi-Key; ComponentLink3URL: https://datasheet.ciiva.com/18697/grm31cr60j107me39-01-18697368.pdf?src-supplier=Digi-Key; ComponentLink3Description: https://datasheet.ciiva.com/18697/grm31cr60j107me39-01-18697368.pdf?src-supplier=Digi-Key; ComponentLink4URL: https://datasheet.ciiva.com/18697/grm31cr60j107me39-01-18697369.pdf?src-supplier=Digi-Key; ComponentLink4Description: https://datasheet.ciiva.com/18697/grm31cr60j107me39-01-18697369.pdf?src-supplier=Digi-Key; Supplier Part Number 1: 490-7217-1-ND
C8 = GRM188C80G106KE47D: as C46 on sheet ADS_2; Supplier 1: Digi-Key; Manufacturer Part Number 1: GRM188C80G106KE47D; Stock 1: 203819; Pricing 1: 1=0.17000, 10=0.11800, 100=0.05990, 500=0.04098, 1000=0.03625 (USD); RoHS: Yes; Mount: Surface Mount; Case/Package: 0603; Weight: 0.000222oz; Case Code (Metric): 1608; Case Code (Imperial): 0603; Min Operating Temperature: -55°C; Max Operating Temperature: 105°C; Capacitance: 10uF; Packaging: Tape and Reel; Voltage Rating: 4V; Dielectric: X6S; Termination: SMD/SMT; Voltage Rating (DC): 4V; Package Quantity: 4000; Length: 0.063inch; Height: 0.8mm; Width: 0.031inch; Thickness: 0.035inch; ComponentLink1URL: http://www.mouser.com/ds/2/281/c02e-2905.pdf?src-supplier=Mouser; ComponentLink1Description: http://www.mouser.com/ds/2/281/c02e-2905.pdf?src-supplier=Mouser; ComponentLink2URL: http://search.murata.co.jp/Ceramy/image/img/A01X/G101/ENG/GRM188C80G106KE47-01.pdf?src-supplier=Digi-Key; ComponentLink2Description: http://search.murata.co.jp/Ceramy/image/img/A01X/G101/ENG/GRM188C80G106KE47-01.pdf?src-supplier=Digi-Key; Supplier Part Number 1: 490-10469-1-ND
C10 = CC0402KRX7R7BB104: as C47 on sheet ADS_2; Supplier 1: Digi-Key; Manufacturer Part Number 1: CC0402KRX7R7BB104; Stock 1: 30032352; Pricing 1: 1=0.10000, 10=0.03200, 100=0.01420, 500=0.01014, 1000=0.00797, 2500=0.00724, 5000=0.00667 (USD); RoHS: Yes; Mount: Surface Mount; Case/Package: 0402; Number of Pins: 2; Case Code (Metric): 1005; Case Code (Imperial): 0402; Min Operating Temperature: -55°C; Max Operating Temperature: 125°C; Voltage Rating: 16V; Voltage Rating (DC): 16V; Packaging: Tape and Reel; Package Quantity: 1; Dielectric: X7R; Termination: SMD/SMT; Composition: Ceramic; Voltage: 16V; Length: 1mm; Height: 0.5mm; Width: 0.02inch; Thickness: 0.022inch; Depth: 0.5mm; Radiation Hardening: No; REACH SVHC: No SVHC; Lead Free: Lead Free; Halogen Free: Halogen Free; ComponentLink1URL: https://datasheet.ciiva.com/11788/0900766b80ce67ed-11788364.pdf?src-supplier=RSComponents; ComponentLink1Description: https://datasheet.ciiva.com/11788/0900766b80ce67ed-11788364.pdf?src-supplier=RSComponents; ComponentLink2URL: https://datasheet.ciiva.com/16625/upy-gphc-x7r-6-3v-to-50v-8-16625511.pdf?src-supplier=Avnet+Europe; ComponentLink2Description: https://datasheet.ciiva.com/16625/upy-gphc-x7r-6-3v-to-50v-8-16625511.pdf?src-supplier=Avnet+Europe; ComponentLink3URL: https://datasheet.ciiva.com/161/mlccorderingcode-161544.pdf?src-supplier=Digi-Key; ComponentLink3Description: https://datasheet.ciiva.com/161/mlccorderingcode-161544.pdf?src-supplier=Digi-Key; ComponentLink4URL: https://datasheet.ciiva.com/161/mlccorderingcode-161545.pdf?src-supplier=Digi-Key; ComponentLink4Description: https://datasheet.ciiva.com/161/mlccorderingcode-161545.pdf?src-supplier=Digi-Key; ComponentLink5URL: https://datasheet.ciiva.com/8033/1734573-8033661.pdf?src-supplier=Element14; ComponentLink5Description: https://datasheet.ciiva.com/8033/1734573-8033661.pdf?src-supplier=Element14; ComponentLink6URL: https://datasheet.ciiva.com/7978/1489800-7978111.pdf?src-supplier=Element14; ComponentLink6Description: https://datasheet.ciiva.com/7978/1489800-7978111.pdf?src-supplier=Element14; ComponentLink7URL: https://datasheet.ciiva.com/8033/1734573-8033663.pdf?src-supplier=Element14; ComponentLink7Description: https://datasheet.ciiva.com/8033/1734573-8033663.pdf?src-supplier=Element14; ComponentLink8URL: https://datasheet.ciiva.com/11587/upy-gphc-x7r-6-3v-to-50v-8-11587305.pdf?src-supplier=Avnet; ComponentLink8Description: https://datasheet.ciiva.com/11587/upy-gphc-x7r-6-3v-to-50v-8-11587305.pdf?src-supplier=Avnet; ComponentLink9URL: https://datasheet.ciiva.com/161/mlccorderingcode-161546.pdf?src-supplier=Digi-Key; ComponentLink9Description: https://datasheet.ciiva.com/161/mlccorderingcode-161546.pdf?src-supplier=Digi-Key; ComponentLink10URL: https://datasheet.ciiva.com/13395/upy-gphc-x7r-6-3v-to-50v-8-13395676.pdf?src-supplier=Mouser; ComponentLink10Description: https://datasheet.ciiva.com/13395/upy-gphc-x7r-6-3v-to-50v-8-13395676.pdf?src-supplier=Mouser; ComponentLink11URL: https://datasheet.ciiva.com/28450/1489800-28450335.pdf?src-supplier=Element14; ComponentLink11Description: https://datasheet.ciiva.com/28450/1489800-28450335.pdf?src-supplier=Element14; Supplier Part Number 1: 311-1338-1-ND
CONN1 = DM3AT-SF-PEJM5: CONN MICRO SD CARD PUSH-PUSH R/A; Manufacturer 1: Hirose; Max Current Rating: 500mA; Voltage Rating: 125V; Connector Type: Connector; Number of Contacts: 8; Gender: Female; Pitch: 1.1mm; Supplier 1: Digi-Key; Manufacturer Part Number 1: DM3AT-SF-PEJM5; Stock 1: 21659; Pricing 1: 1=2.67000, 10=2.56100, 25=2.34760, 50=2.24080, 100=2.13400, 250=1.86724, 500=1.81390 (USD); RoHS: Yes; Mount: Surface Mount,Standard; Contact Material: Copper Alloy; Contact Plating: Gold; Housing Material: Polymer; Min Operating Temperature: -25°C; Max Operating Temperature: 85°C; Number of Rows: 1; Packaging: Tape and Reel; Package Quantity: 1; Current Rating: 500mA; Termination: SMD/SMT; Max Voltage Rating (AC): 125V; Number of Positions: 8; Orientation: Right Angle; Length: 15.95mm; Height: 1.68mm; Width: 13.85mm; Depth: 15.95mm; Radiation Hardening: No; REACH SVHC: No SVHC; Lead Free: Lead Free; Flammability Rating: UL94 V-0; ComponentLink1URL: https://datasheet.ciiva.com/683/e60900232-683393.pdf?src-supplier=Digi-Key; ComponentLink1Description: https://datasheet.ciiva.com/683/e60900232-683393.pdf?src-supplier=Digi-Key; ComponentLink2URL: https://datasheet.ciiva.com/683/e60900232-683394.pdf?src-supplier=Digi-Key; ComponentLink2Description: https://datasheet.ciiva.com/683/e60900232-683394.pdf?src-supplier=Digi-Key; ComponentLink3URL: https://datasheet.ciiva.com/683/e60900232-683395.pdf?src-supplier=Digi-Key; ComponentLink3Description: https://datasheet.ciiva.com/683/e60900232-683395.pdf?src-supplier=Digi-Key; ComponentLink4URL: https://datasheet.ciiva.com/46418/1697167-46418261.pdf?src-supplier=Element14; ComponentLink4Description: https://datasheet.ciiva.com/46418/1697167-46418261.pdf?src-supplier=Element14; ComponentLink5URL: https://datasheet.ciiva.com/3122/e60900232-3122534.pdf?src-supplier=Avnet; ComponentLink5Description: https://datasheet.ciiva.com/3122/e60900232-3122534.pdf?src-supplier=Avnet; ComponentLink6URL: https://datasheet.ciiva.com/46418/1697167-46418262.pdf?src-supplier=Element14; ComponentLink6Description: https://datasheet.ciiva.com/46418/1697167-46418262.pdf?src-supplier=Element14; ComponentLink7URL: https://datasheet.ciiva.com/16205/e60900232-16205727.pdf?src-supplier=Future+Electronics; ComponentLink7Description: https://datasheet.ciiva.com/16205/e60900232-16205727.pdf?src-supplier=Future+Electronics; Supplier Part Number 1: HR1964CT-ND
U1 = LIS3DHTR: ACCEL 2-16G I2C/SPI 16LGA; Manufacturer 1: STMicroelectronics; Interface: I2C,SPI; Sensor Type: 3 Axis; Max Supply Voltage: 3.6V; Min Supply Voltage: 1.71V; Operating Supply Voltage: 2.5V; Bandwidth: 5kHz; Resolution: 16b; Operating Supply Current: 11uA; Output Type: Digital; Axis: X, Y, Z; Supplier 1: Digi-Key; Manufacturer Part Number 1: LIS3DHTR; Stock 1: 56055; Pricing 1: 1=1.63000, 10=1.46000, 100=1.13850, 500=0.94050, 1000=0.74250 (USD); RoHS: Yes; Case/Package: LGA; Number of Pins: 16; Contact Plating: Gold; Min Operating Temperature: -40°C; Max Operating Temperature: 85°C; Package Quantity: 1; Packaging: Tape and Reel; Max Supply Voltage (DC): 3.6V; Min Supply Voltage (DC): 1.71V; Length: 3mm; Height: 1mm; Depth: 3mm; Width: 3mm; Radiation Hardening: No; REACH SVHC: No SVHC; Lead Free: Lead Free; ComponentLink1URL: https://datasheet.ciiva.com/7621/1718591-7621744.pdf?src-supplier=Element14; ComponentLink1Description: https://datasheet.ciiva.com/7621/1718591-7621744.pdf?src-supplier=Element14; ComponentLink2URL: https://datasheet.ciiva.com/16638/cd00274221-16638192.pdf?src-supplier=Avnet+Europe; ComponentLink2Description: https://datasheet.ciiva.com/16638/cd00274221-16638192.pdf?src-supplier=Avnet+Europe; ComponentLink3URL: https://datasheet.ciiva.com/5296/cd00274221-117431-5296513.pdf?src-supplier=Mouser; ComponentLink3Description: https://datasheet.ciiva.com/5296/cd00274221-117431-5296513.pdf?src-supplier=Mouser; ComponentLink4URL: https://datasheet.ciiva.com/26928/lis3dhtr-26928589.pdf?src-supplier=IIIC; ComponentLink4Description: https://datasheet.ciiva.com/26928/lis3dhtr-26928589.pdf?src-supplier=IIIC; ComponentLink5URL: https://datasheet.ciiva.com/2810/cd00274221-2810008.pdf?src-supplier=Digi-Key; ComponentLink5Description: https://datasheet.ciiva.com/2810/cd00274221-2810008.pdf?src-supplier=Digi-Key; ComponentLink6URL: https://datasheet.ciiva.com/2810/cd00274221-2810009.pdf?src-supplier=Digi-Key; ComponentLink6Description: https://datasheet.ciiva.com/2810/cd00274221-2810009.pdf?src-supplier=Digi-Key; ComponentLink7URL: https://datasheet.ciiva.com/48495/cd00274221-48495849.pdf?src-supplier=Avnet; ComponentLink7Description: https://datasheet.ciiva.com/48495/cd00274221-48495849.pdf?src-supplier=Avnet; ComponentLink8URL: https://datasheet.ciiva.com/2810/cd00274221-2810010.pdf?src-supplier=Digi-Key; ComponentLink8Description: https://datasheet.ciiva.com/2810/cd00274221-2810010.pdf?src-supplier=Digi-Key; ComponentLink9URL: https://datasheet.ciiva.com/16216/cd00274221-16216362.pdf?src-supplier=Future+Electronics; ComponentLink9Description: https://datasheet.ciiva.com/16216/cd00274221-16216362.pdf?src-supplier=Future+Electronics; ComponentLink10URL: https://datasheet.ciiva.com/16470/cd00274221-16470411.pdf?src-supplier=Avnet+Asia; ComponentLink10Description: https://datasheet.ciiva.com/16470/cd00274221-16470411.pdf?src-supplier=Avnet+Asia; ComponentLink11URL: https://datasheet.ciiva.com/3271/cd00274221-3271807.pdf?src-supplier=Avnet; ComponentLink11Description: https://datasheet.ciiva.com/3271/cd00274221-3271807.pdf?src-supplier=Avnet; Supplier Part Number 1: 497-10613-1-ND
U2 = SN74LVC1G32DCKR: IC GATE OR 1CH 2-INP SC70-5; Manufacturer 1: Texas Instruments; Output Current: 32mA; Number of Inputs: 2; Min Supply Voltage: 1.65V; Max Supply Voltage: 5.5V; Propagation Delay: 4ns; Number of Elements: 1; Quiescent Current: 10uA; High Level Output Current: -32mA; Turn-On Delay Time: 4.5ns; Schmitt Trigger Input: No; Supplier 1: Digi-Key; Manufacturer Part Number 1: SN74LVC1G32DCKR; Stock 1: 153903; Pricing 1: 1=0.33000, 10=0.24700, 100=0.14000, 500=0.09270, 1000=0.07107 (USD); RoHS: Yes; Mount: Surface Mount; Case/Package: SC; Number of Pins: 5; Weight: 8.8E-05oz; Contact Plating: Gold; Min Operating Temperature: -40°C; Max Operating Temperature: 125°C; Max Output Current: 32mA; Package Quantity: 1; Packaging: Tape and Reel; Logic Function: OR; Number of Outputs: 1; Number of Circuits: 1; Low Level Output Current: 32mA; Number of Gates: 1; Number of Input Lines: 2; Number of Output Lines: 1; Termination: SMD/SMT; Number of Bits: 1; Length: 2mm; Height: 0.9mm; Width: 1.25mm; Radiation Hardening: No; REACH SVHC: No SVHC; Lead Free: Lead Free; ComponentLink1URL: https://datasheet.ciiva.com/1864/sn74lvc1g32-1864192.pdf?src-supplier=Digi-Key; ComponentLink1Description: https://datasheet.ciiva.com/1864/sn74lvc1g32-1864192.pdf?src-supplier=Digi-Key; ComponentLink2URL: https://datasheet.ciiva.com/6124/1768050-6124560.pdf?src-supplier=Farnell; ComponentLink2Description: https://datasheet.ciiva.com/6124/1768050-6124560.pdf?src-supplier=Farnell; ComponentLink3URL: https://datasheet.ciiva.com/15090/getdatasheetpartid-127914-15090759.pdf?src-supplier=Verical; ComponentLink3Description: https://datasheet.ciiva.com/15090/getdatasheetpartid-127914-15090759.pdf?src-supplier=Verical; ComponentLink4URL: https://datasheet.ciiva.com/27049/756781-27049784.pdf?src-supplier=Jameco; ComponentLink4Description: https://datasheet.ciiva.com/27049/756781-27049784.pdf?src-supplier=Jameco; ComponentLink5URL: https://datasheet.ciiva.com/7783/1768050-7783469.pdf?src-supplier=Element14; ComponentLink5Description: https://datasheet.ciiva.com/7783/1768050-7783469.pdf?src-supplier=Element14; ComponentLink6URL: https://datasheet.ciiva.com/14290/sn74lvc1g32-14290781.pdf?src-supplier=Avnet; ComponentLink6Description: https://datasheet.ciiva.com/14290/sn74lvc1g32-14290781.pdf?src-supplier=Avnet; ComponentLink7URL: https://datasheet.ciiva.com/7783/1768050-7783470.pdf?src-supplier=Element14; ComponentLink7Description: https://datasheet.ciiva.com/7783/1768050-7783470.pdf?src-supplier=Element14; ComponentLink8URL: https://datasheet.ciiva.com/26048/sn74lvc1g32-26048814.pdf?src-supplier=Avnet+Europe; ComponentLink8Description: https://datasheet.ciiva.com/26048/sn74lvc1g32-26048814.pdf?src-supplier=Avnet+Europe; ComponentLink9URL: https://datasheet.ciiva.com/1864/sn74lvc1g32-1864193.pdf?src-supplier=Digi-Key; ComponentLink9Description: https://datasheet.ciiva.com/1864/sn74lvc1g32-1864193.pdf?src-supplier=Digi-Key; ComponentLink10URL: https://datasheet.ciiva.com/16503/sn74lvc1g32-16503418.pdf?src-supplier=Avnet+Asia; ComponentLink10Description: https://datasheet.ciiva.com/16503/sn74lvc1g32-16503418.pdf?src-supplier=Avnet+Asia; ComponentLink11URL: https://datasheet.ciiva.com/1864/sn74lvc1g32-1864191.pdf?src-supplier=Digi-Key; ComponentLink11Description: https://datasheet.ciiva.com/1864/sn74lvc1g32-1864191.pdf?src-supplier=Digi-Key; Supplier Part Number 1: 296-9848-1-ND